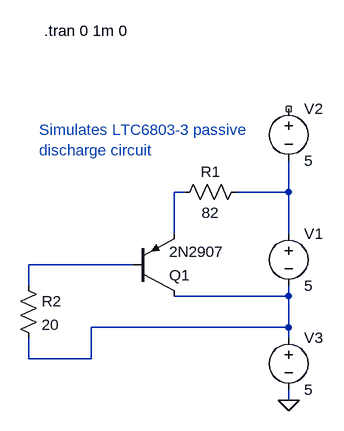
[diagram p0: schematic ltc6803_passive_discharge.asc]
ltc6803_passive_discharge.asc, the LTspice schematic file:
Version 4
SHEET 1 880 680
WIRE 288 32 272 32
WIRE 448 32 448 -16
WIRE 448 32 368 32
WIRE 272 96 272 32
WIRE 448 96 448 32
WIRE 208 144 48 144
WIRE 48 176 48 144
WIRE 448 192 448 176
WIRE 448 192 272 192
WIRE 448 240 448 192
WIRE 448 240 144 240
WIRE 448 256 448 240
WIRE 48 288 48 256
WIRE 144 288 144 240
WIRE 144 288 48 288
WIRE 448 352 448 336
FLAG 448 352 0
SYMBOL pnp 208 192 M180
SYMATTR InstName Q1
SYMATTR Value 2N2907
SYMBOL res 384 16 R90
WINDOW 0 0 56 VBottom 2
WINDOW 3 32 56 VTop 2
SYMATTR InstName R1
SYMATTR Value 82
SYMBOL voltage 448 80 R0
WINDOW 123 0 0 Left 2
WINDOW 39 0 0 Left 2
SYMATTR InstName V1
SYMATTR Value 5
SYMBOL voltage 448 -112 R0
WINDOW 123 0 0 Left 2
WINDOW 39 0 0 Left 2
SYMATTR InstName V2
SYMATTR Value 5
SYMBOL res 32 160 R0
SYMATTR InstName R2
SYMATTR Value 20
SYMBOL voltage 448 240 R0
WINDOW 123 0 0 Left 2
WINDOW 39 0 0 Left 2
SYMATTR InstName V3
SYMATTR Value 5
TEXT 72 -216 Left 2 !.tran 0 1m 0
TEXT 64 -64 Left 2 ;Simulates LTC6803-3 passive\ndischarge circuit

The netlist it stands for:
* ltc6803_passive_discharge.asc
Q1 N004 N003 N001 0 2N2907
R1 N002 N001 82
V1 N002 N004 5
V2 NC_01 N002 5
R2 N003 N004 20
V3 N004 0 5
.model NPN NPN
.model PNP PNP
.lib standard.bjt
.tran 0 1m 0
* Simulates LTC6803-3 passive
* discharge circuit
.backanno
.end